# EAGLE schematic optoisolator-shield (EAGLE 6.5.0)
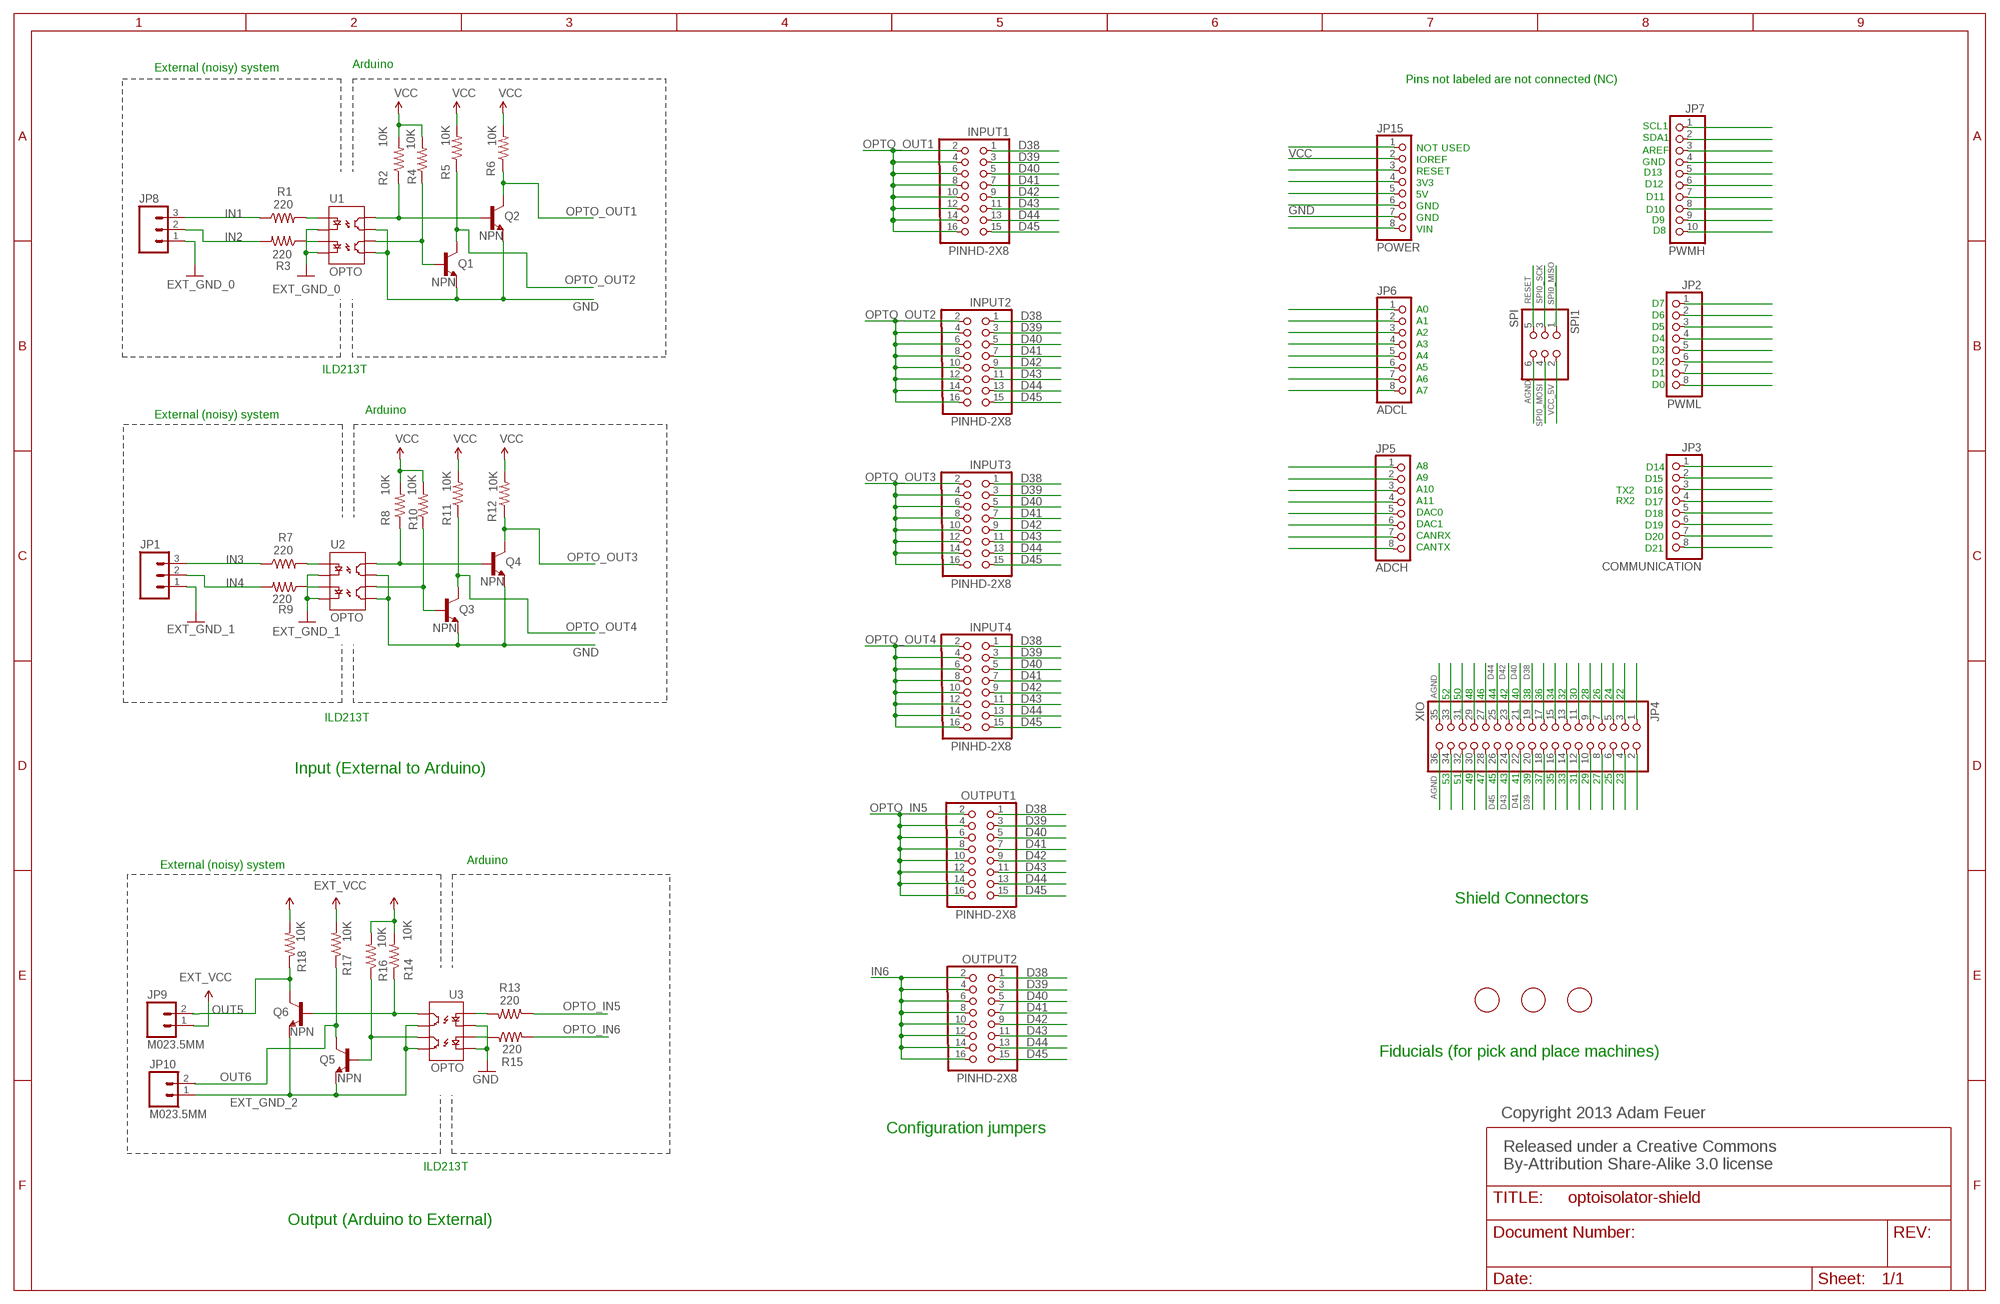
[diagram p0: schematic, sheet 1]

## Parts
INPUT1  PINHD-2X8  [2X08]
INPUT2  PINHD-2X8  [2X08]
INPUT3  PINHD-2X8  [2X08]
INPUT4  PINHD-2X8  [2X08]
JP1  M03SCREW  [SCREWTERMINAL-3.5MM-3]
JP2  PWML  PINHD-1X8  [1X08]
JP3  COMMUNICATION  PINHD-1X8  [1X08]
JP4  XIO  PINHD-2X18  [2X18]
JP5  ADCH  PINHD-1X8  [1X08]
JP6  ADCL  PINHD-1X8  [1X08]
JP7  PWMH  PINHD-1X10  [1X10]
JP8  M03SCREW  [SCREWTERMINAL-3.5MM-3]
JP9  M023.5MM  [SCREWTERMINAL-3.5MM-2]
JP10  M023.5MM  [SCREWTERMINAL-3.5MM-2]
JP15  POWER  PINHD-1X8  [1X08]
OUTPUT1  PINHD-2X8  [2X08]
OUTPUT2  PINHD-2X8  [2X08]
Q1  NPN  TRANSISTOR_NPNSOT23-3  [SOT23-3]
Q2  NPN  TRANSISTOR_NPNSOT23-3  [SOT23-3]
Q3  NPN  TRANSISTOR_NPNSOT23-3  [SOT23-3]
Q4  NPN  TRANSISTOR_NPNSOT23-3  [SOT23-3]
Q5  NPN  TRANSISTOR_NPNSOT23-3  [SOT23-3]
Q6  NPN  TRANSISTOR_NPNSOT23-3  [SOT23-3]
R1  220  RESISTOR0402  [C0402]
R2  10K  RESISTOR0402  [C0402]
R3  220  RESISTOR0402  [C0402]
R4  10K  RESISTOR0402  [C0402]
R5  10K  RESISTOR0402  [C0402]
R6  10K  RESISTOR0402  [C0402]
R7  220  RESISTOR0402  [C0402]
R8  10K  RESISTOR0402  [C0402]
R9  220  RESISTOR0402  [C0402]
R10  10K  RESISTOR0402  [C0402]
R11  10K  RESISTOR0402  [C0402]
R12  10K  RESISTOR0402  [C0402]
R13  220  RESISTOR0402  [C0402]
R14  10K  RESISTOR0402  [C0402]
R15  220  RESISTOR0402  [C0402]
R16  10K  RESISTOR0402  [C0402]
R17  10K  RESISTOR0402  [C0402]
R18  10K  RESISTOR0402  [C0402]
SPI1  SPI  PINHD-2X3  [2X03]
U1  OPTO  OPTOISOLATOR-2SOIC8  [SO08-2]
U2  OPTO  OPTOISOLATOR-2SOIC8  [SO08-2]
U3  OPTO  OPTOISOLATOR-2SOIC8  [SO08-2]
U$2  FIDUCIAL  [FIDUCIAL_1MM]
U$5  FIDUCIAL  [FIDUCIAL_1MM]
U$6  FIDUCIAL  [FIDUCIAL_1MM]

## Nets
!ADC_RESET_1: JP4.28
AGND: JP4.35 JP4.36 SPI1.6
D38: INPUT1.1 INPUT2.1 INPUT3.1 INPUT4.1 JP4.19 OUTPUT1.1 OUTPUT2.1
D39: INPUT1.3 INPUT2.3 INPUT3.3 INPUT4.3 JP4.20 OUTPUT1.3 OUTPUT2.3
D40: INPUT1.5 INPUT2.5 INPUT3.5 INPUT4.5 JP4.21 OUTPUT1.5 OUTPUT2.5
D41: INPUT1.7 INPUT2.7 INPUT3.7 INPUT4.7 JP4.22 OUTPUT1.7 OUTPUT2.7
D42: INPUT1.9 INPUT2.9 INPUT3.9 INPUT4.9 JP4.23 OUTPUT1.9 OUTPUT2.9
D43: INPUT1.11 INPUT2.11 INPUT3.11 INPUT4.11 JP4.24 OUTPUT1.11 OUTPUT2.11
D44: INPUT1.13 INPUT2.13 INPUT3.13 INPUT4.13 JP4.25 OUTPUT1.13 OUTPUT2.13
D45: INPUT1.15 INPUT2.15 INPUT3.15 INPUT4.15 JP4.26 OUTPUT1.15 OUTPUT2.15
EXT_GND_0: JP8.1 U1.2(C1) U1.4(C2)
EXT_GND_1: JP1.1 U2.2(C1) U2.4(C2)
EXT_GND_2: JP10.1 Q5.2(E) Q6.2(E) U3.5(EM2) U3.7(EM1)
EXT_VCC: JP9.1 R14.2 R16.2 R17.2 R18.2 ; supply symbol labelled EXTERNAL_VCC
GND: JP15.7 Q1.2(E) Q2.2(E) Q3.2(E) Q4.2(E) U1.5(EM2) U1.7(EM1) U2.5(EM2) U2.7(EM1) U3.2(C1) U3.4(C2)
IN1: JP8.3 R1.1
IN2: JP8.2 R3.2
IN3: JP1.3 R7.1
IN4: JP1.2 R9.2
IN6: OUTPUT2.2 OUTPUT2.4 OUTPUT2.6 OUTPUT2.8 OUTPUT2.10 OUTPUT2.12 OUTPUT2.14 OUTPUT2.16
N$1: JP7.9
N$2: JP5.1
N$3: JP15.1
N$4: JP3.7
N$5: JP2.7
N$6: R1.2 U1.1(A1)
N$7: JP7.3
N$8: JP7.4
N$9: JP7.5
N$10: JP7.6
N$11: JP7.7
N$12: JP7.10
N$13: JP2.1
N$14: JP2.2
N$15: JP2.3
N$16: JP2.5
N$17: JP2.6
N$18: JP2.8
N$19: JP3.1
N$20: R3.1 U1.3(A2)
N$21: R7.2 U2.1(A1)
N$22: JP3.2
N$23: R9.1 U2.3(A2)
N$24: R13.2 U3.1(A1)
N$25: JP3.5
N$26: JP3.6
N$27: R15.1 U3.3(A2)
N$32: JP3.8
N$37: JP5.8
N$43: JP5.7
N$44: JP5.6
N$55: JP5.5
N$56: JP5.4
N$57: JP5.3
N$58: JP5.2
N$65: JP6.4
N$66: JP6.3
N$68: JP6.2
N$69: JP15.8
N$71: JP15.6
N$72: JP15.3
N$73: JP4.34
N$74: JP4.32
N$89: JP4.18
N$91: JP4.16
N$92: JP4.10
N$93: JP4.3
N$94: JP4.9
N$96: JP4.15
N$97: JP4.17
N$109: JP4.31
N$110: JP6.6
N$112: JP6.7
N$114: JP15.5
N$115: JP4.1
N$116: JP4.2
N$569: JP6.8
N$571: JP15.4
N$572: JP6.1
N$573: JP6.5
N$574: JP7.1
N$575: JP7.2
N$576: JP7.8
N$577: JP2.4
N$578: JP3.3
N$579: JP3.4
N$580: JP4.5
N$581: JP4.7
N$582: JP4.11
N$583: JP4.13
N$584: JP4.27
N$585: JP4.29
N$586: JP4.33
N$587: JP4.4
N$588: JP4.6
N$589: JP4.8
N$590: JP4.12
N$591: JP4.14
N$592: JP4.30
OPTO_IN5: OUTPUT1.2 OUTPUT1.4 OUTPUT1.6 OUTPUT1.8 OUTPUT1.10 OUTPUT1.12 OUTPUT1.14 OUTPUT1.16 R13.1
OPTO_IN6: R15.2
OPTO_OUT1: INPUT1.2 INPUT1.4 INPUT1.6 INPUT1.8 INPUT1.10 INPUT1.12 INPUT1.14 INPUT1.16 Q2.3(C) R6.1
OPTO_OUT2: INPUT2.2 INPUT2.4 INPUT2.6 INPUT2.8 INPUT2.10 INPUT2.12 INPUT2.14 INPUT2.16 Q1.3(C) R5.1
OPTO_OUT3: INPUT3.2 INPUT3.4 INPUT3.6 INPUT3.8 INPUT3.10 INPUT3.12 INPUT3.14 INPUT3.16 Q4.3(C) R12.1
OPTO_OUT4: INPUT4.2 INPUT4.4 INPUT4.6 INPUT4.8 INPUT4.10 INPUT4.12 INPUT4.14 INPUT4.16 Q3.3(C) R11.1
OUT1N1: Q4.1(B) R8.1 U2.8(CL1)
OUT1N2: Q2.1(B) R2.1 U1.8(CL1)
OUT1N3: Q6.1(B) R14.1 U3.8(CL1)
OUT2N1: Q3.1(B) R10.1 U2.6(CL2)
OUT2N2: Q1.1(B) R4.1 U1.6(CL2)
OUT2N3: Q5.1(B) R16.1 U3.6(CL2)
OUT5: Q6.3(C) R18.1
OUT6: Q5.3(C) R17.1
RESET: SPI1.5
SPI0_MISO: SPI1.1
SPI0_MOSI: SPI1.4
SPI0_SCK: SPI1.3
VCC: JP15.2 R2.2 R4.2 R5.2 R6.2 R8.2 R10.2 R11.2 R12.2
VCC_5V: SPI1.2
Unconnected: JP9.2 JP10.2

## Notes on the sheet
- Arduino
- External (noisy) system
- Pins not labeled are not connected (NC)
- SCL1
- SDA1
- NOT USED | AREF
- IOREF | GND
- RESET | D13
- 3V3 | D12
- 5V | D11
- GND
- D10
- GND | D9
- VIN | D8
- D7
- A0
- D6
- A1
- D5
- A2
- D4
- A3
- D3
- A4
- D2
- ILD213T | A5
- D1
- A6
- D0
- A7
- Arduino
- External (noisy) system
- A8 | D14
- A9 | D15
- A10 | TX2 | D16
- A11 | RX2 | D17
- DAC0 | D18
- DAC1 | D19
- CANRX | D20
- CANTX | D21
- 52 | 50 | 48 | 46 | 44 | 42 | 40 | 38 | 36 | 34 | 32 | 30 | 28 | 26 | 24 | 22
- ILD213T
- Input (External to Arduino)
- 53 | 51 | 49 | 47 | 45 | 43 | 41 | 39 | 37 | 35 | 33 | 31 | 29 | 27 | 25 | 23
- Arduino
- External (noisy) system
- Shield Connectors
- Fiducials (for pick and place machines)
- Copyright 2013 Adam Feuer
- Configuration jumpers
- Released under a Creative Commons 
  By-Attribution Share-Alike 3.0 license
- ILD213T
- Output (Arduino to External)

## Library data of the parts
INPUT1-INPUT4 OUTPUT1 OUTPUT2 = headers:PINHD-2X8
JP1 JP8 = SparkFun-Connectors:M03: Header 3 Standard 3-pin 0.1" header. Use with straight break away headers (SKU : PRT-00116), right angle break away headers (PRT-00553), swiss pins (PRT-00743), machine pins (PRT-00117), and female headers (PRT-00115). Molex polarized connector foot print use with SKU : PRT-08232 with associated crimp pins and housings.
JP2 JP3 JP5 JP6 JP15 = SmartPrj:PINHD-1X8: PIN HEADER
JP4 = SmartPrj:PINHD-2X18: PIN HEADER
JP7 = SmartPrj:PINHD-1X10: PIN HEADER
JP9 JP10 = SparkFun-Connectors:M02: Standard 2-pin 0.1" header. Use with - straight break away headers ( PRT-00116) - right angle break away headers (PRT-00553) - swiss pins (PRT-00743) - machine pins (PRT-00117) - female headers (PRT-00115) Molex polarized connector foot print use with: PRT-08233 with associated crimp pins and housings. 2.54_SCREWTERM for use with PRT-10571. 3.5mm Screw Terminal footprints for PRT-08084 5mm Screw Terminal footprints for use with PRT-08433
Q1-Q6 = SparkFun:TRANSISTOR_NPN: Transistor NPN BJT configuration in SOT23 package. MMBT2222 is the common NPN we use. Double check BCE configuration again layout.
R1-R18 = SparkFun:RESISTOR: Resistor Basic schematic elements and footprints for 0603, 1206, and PTH 1/10th watt (small) resistors.
SPI1 = SmartPrj:PINHD-2X3: PIN HEADER
U1-U3 = SparkFun:OPTOISOLATOR-2: Description: Dual gate opto isolator. Vishay part : ILD213T
U$2 U$5 U$6 = adafruit:FIDUCIAL: For use by pick and place machines to calibrate the vision/machine, 1mm By microbuilder.eu